# EAGLE design dip8_a1 (EAGLE 5.11)
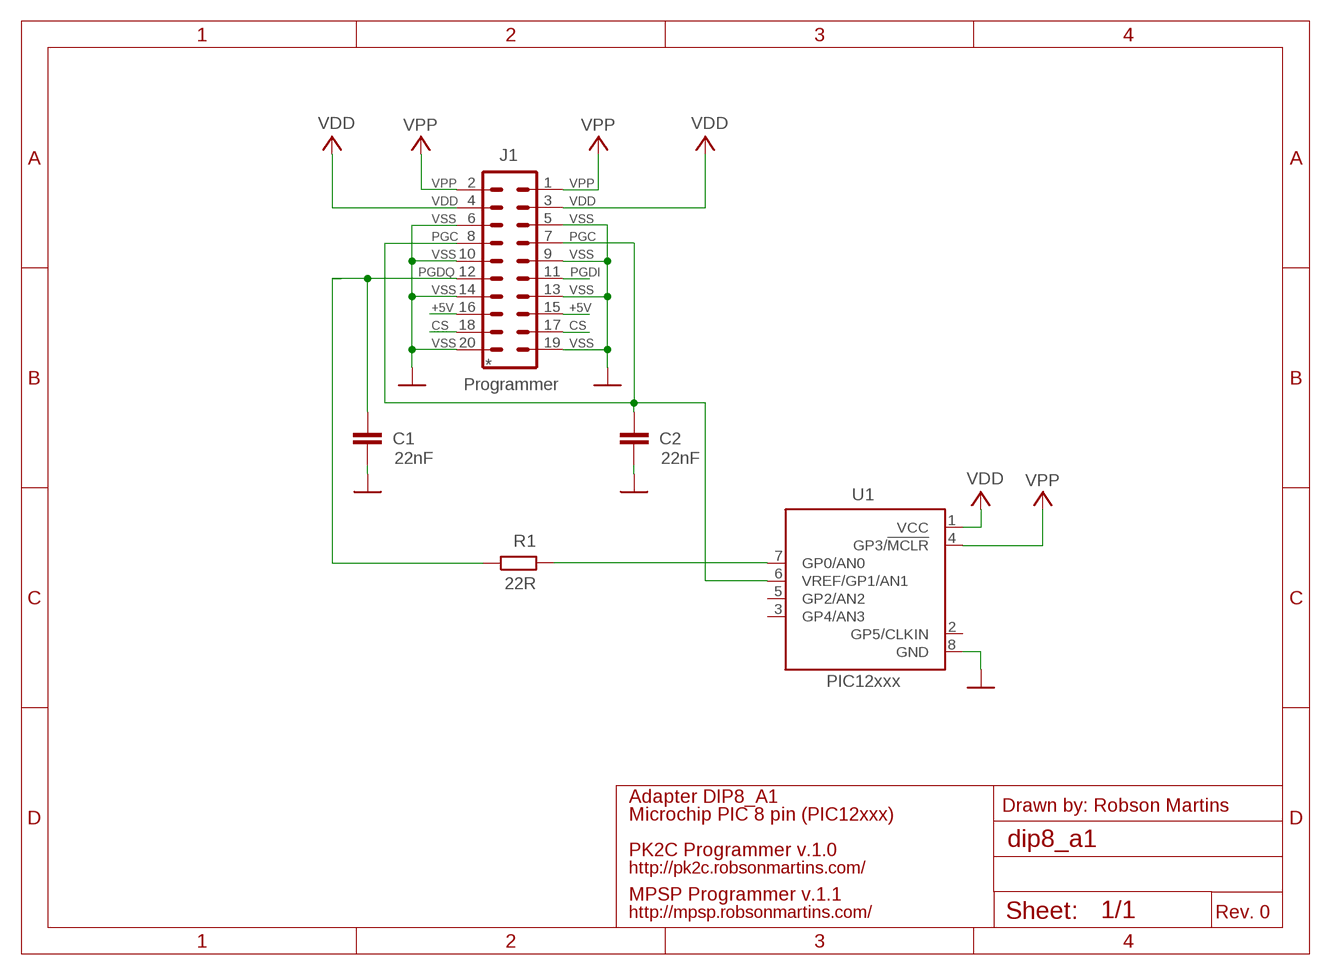
[diagram p0: schematic, sheet 1]

## Parts
C1  22nF  C-EU025-025X050  [C025-025X050]
C2  22nF  C-EU025-025X050  [C025-025X050]
J1  Programmer  MA10-2  [MA10-2]
R1  22R  R-EU_0204/7  [0204/7]
U1  PIC12xxx  PIC12F675P  [DIL8]

## Nets
+5V: J1.15 J1.16
CS: J1.17 J1.18
GND: C1.2 C2.2 J1.5 J1.6 J1.9 J1.10 J1.13 J1.14 J1.19 J1.20 U1.8(GND)
PGC: C2.1 J1.7 J1.8 U1.6(VREF/GP1/AN1)
PGD: C1.1 J1.12 R1.1
PGD_CHIP: R1.2 U1.7(GP0/AN0)
PGDI: J1.11
VDD: J1.3 J1.4 U1.1(VCC)
VPP: J1.1 J1.2 U1.4(GP3/!MCLR)
Unconnected: U1.2(GP5/CLKIN) U1.3(GP4/AN3) U1.5(GP2/AN2)

## Notes on the sheet
- VPP | VPP
- VDD | VDD
- VSS | VSS
- PGC | PGC
- VSS | VSS
- PGDQ | PGDI
- VSS | VSS
- +5V | +5V
- CS | CS
- VSS | VSS
- *
- Adapter DIP8_A1
- Drawn by: Robson Martins
- Microchip PIC 8 pin (PIC12xxx)
- PK2C Programmer v.1.0
- http://pk2c.robsonmartins.com/
- MPSP Programmer v.1.1
- http://mpsp.robsonmartins.com/ | Rev. 0

## Library data of the parts
C1 C2 = rcl:C-EU: CAPACITOR, European symbol
J1 = con-lstb:MA10-2: PIN HEADER; OC_FARNELL: unknown; OC_NEWARK: unknown
R1 = resistor:R-EU_: RESISTOR, European symbol
U1 = microchip:PIC12F675: 8-Pin FLASH-Based 8-Bit CMOS Microcontroller Precision Internal 4 MHz oscillator factory calibrated to ±1% Low Power Features: Standby Current: - 1 nA @ 2.0V, typical Operating Current: - 8.5µA @ 32 kHz, 2.0V, typical - 100µA @ 1 MHz, 2.0V, typical Watchdog Timer Current: - 300 nA @ 2.0V, typical Timer1 oscillator current: - 4µA @ 32 kHz, 2.0V, typical Analog-to-Digital Converter module: - 10-bit resolution - Programmable 4-channel input - Voltage reference input Source: http://www.microchip.com .. 41190E.pdf; MF: MICROCHIP; MPN: PIC12F675-E/P; OC_FARNELL: 9759018; OC_NEWARK: 92C4340

## Board
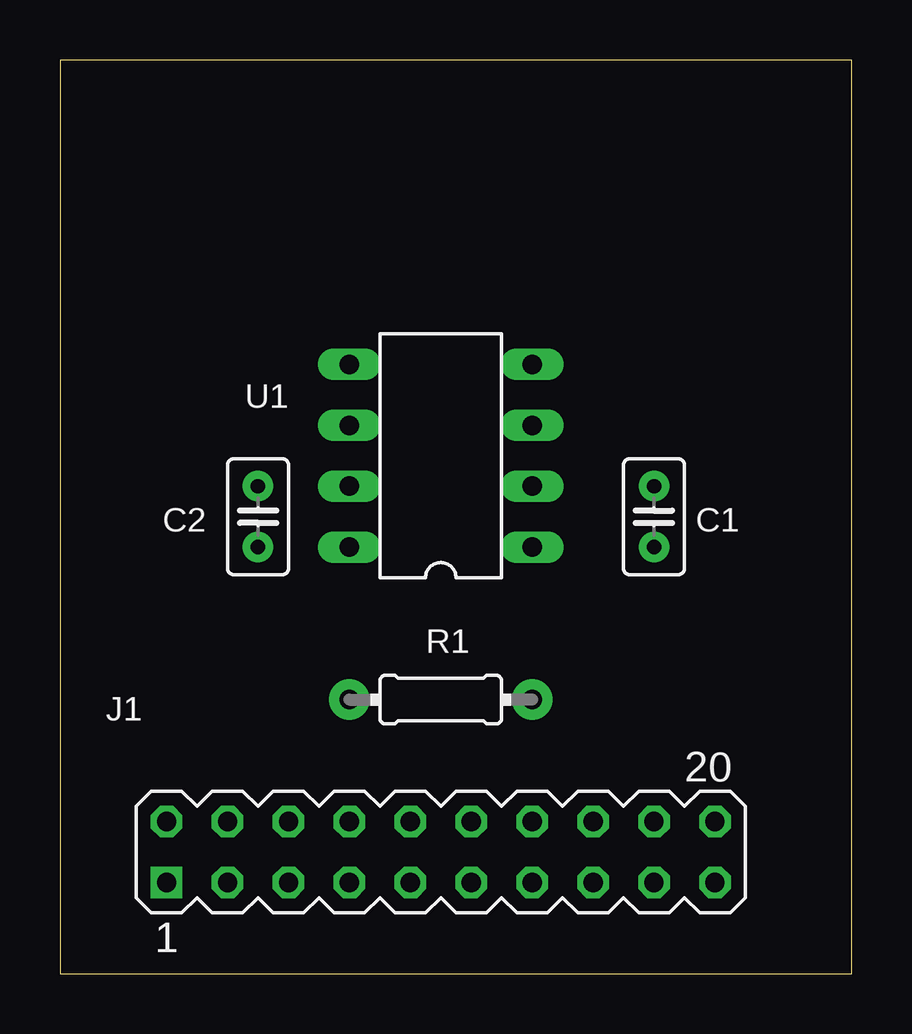
[diagram p1: board, top side]
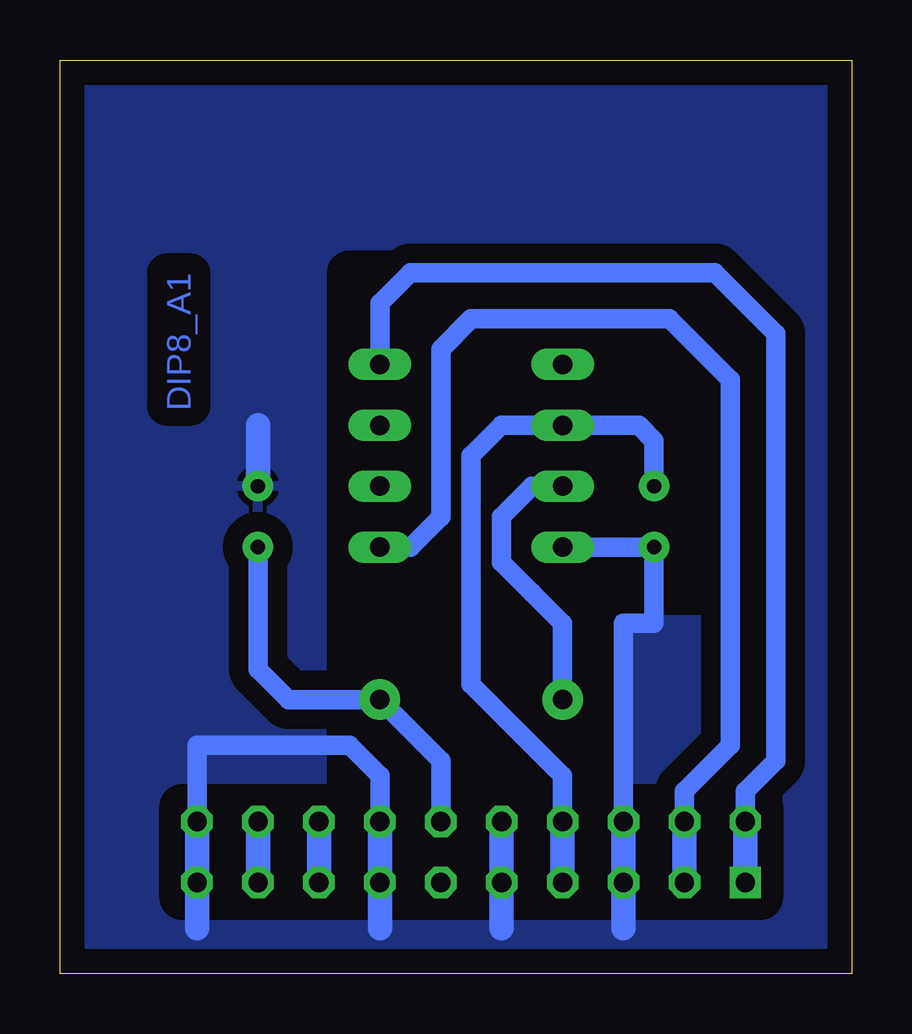
[diagram p2: board, bottom side, seen from below]

Size 33.02 x 38.08 mm. Coordinates in mm from the lower left corner, seen from the top.
Outline: 33.02,0 33.02,38.08 0,38.08 0,0 33.02,0
Copper layers (1*16): Top 0.035mm / dielectric 1.5mm / Bottom 0.035mm
Design rules "default": minimum track width 10mil, minimum drill 24mil, track to track 8mil, track to pad 8mil, pad to pad 8mil, via to via 8mil, smd to smd 8mil, copper to edge 40mil, drill to drill 8mil, minimum pad ring 10mil, minimum via ring 8mil, stop-mask expansion 4mil, vias tented up to drill 0mil, thermal gap 10mil
bRestrict: area 3.8,3.2 to 27.9,15.9; area 5.7,15.9 to 21,29.2

### Footprints (pad centres in the part's own frame; a part is rotated, then mirrored left to right if it is on the bottom)
C025-025X050 = drill 0.6 pad 1.27 round: 1 -1.27,0; 2 1.27,0
MA10-2 = drill 0.8 pad 1.27 square: 1 -11.43,-1.27 | drill 0.8 pad 1.27 octagon: 2 -11.43,1.27; 3 -8.89,-1.27; 4 -8.89,1.27; 5 -6.35,-1.27; 6 -6.35,1.27; 7 -3.81,-1.27; 8 -3.81,1.27; 9 -1.27,-1.27; 10 -1.27,1.27; 11 1.27,-1.27; 12 1.27,1.27; 13 3.81,-1.27; 14 3.81,1.27; 15 6.35,-1.27; 16 6.35,1.27; 17 8.89,-1.27; 18 8.89,1.27; 19 11.43,-1.27; 20 11.43,1.27
0204/7 = drill 0.813 pad 1.676 round: 1 -3.81,0 | drill 0.8 pad 1.676 round: 2 3.81,0
DIL8 = drill 0.813 long: 1 -3.81,-3.81; 2 -1.27,-3.81; 3 1.27,-3.81; 4 3.81,-3.81; 5 3.81,3.81; 6 1.27,3.81; 7 -1.27,3.81; 8 -3.81,3.81

### Placement (x,y rotation side)
C1  24.77,19.05 90 top
C2  8.26,19.05 270 top
J1  15.88,5.08 0 top
R1  15.88,11.43 180 top
U1  15.88,21.59 90 top

### Tracks (layer width: path | path; a pad name or v marks a point on that pad's centre or on a via)
+5V
  Bottom 1.016: J1.15 J1.16
CS
  Bottom 1.016: J1.17 J1.18
GND
  Bottom 0.813: U1.8 C2.2 8.26,14.61 9.53,14.61 J1.6 | J1.14 19.69,8.26 20.96,9.53 27.31,9.53 J1.20
  Bottom 1.016: J1.6 J1.5 9.53,1.91 | J1.10 J1.9 14.61,1.91 | J1.14 J1.13 19.69,1.91 | J1.20 J1.19 27.31,1.91 | C1.2 24.77,22.86
  pour Bottom (isolate 0.813): 33.02,0 0,0 0,38.1 33.02,38.1
PGC
  Bottom 0.813: C2.1 8.26,22.23 8.89,22.86 U1.6 14.61,22.86 15.88,21.59 15.88,12.06 12.07,8.26 J1.8
  Bottom 1.016: J1.7 J1.8
PGD
  Bottom 0.813: C1.1 24.77,12.7 23.5,11.43 R1.1 17.15,8.89 J1.12
PGD_CHIP
  Bottom 0.813: U1.7 13.34,20.32 14.61,19.05 14.61,17.14 13.34,15.88 12.07,14.61 R1.2
VDD
  Bottom 0.813: J1.4 6.99,7.62 5.08,9.53 5.08,24.77 7.62,27.3 15.88,27.3 17.15,26.04 17.15,19.05 18.42,17.78 U1.1
  Bottom 1.016: J1.3 J1.4
VPP
  Bottom 0.813: U1.4 19.69,27.3 19.69,27.94 18.42,29.21 5.72,29.21 3.18,26.67 3.18,8.89 4.45,7.62 J1.1
  Bottom 1.016: J1.1 J1.2

### Text on the board
Bottom: DIP8_A1
tDocu: Microchip PIC | PIC 12xxx | DIP8_A1 | Adapter | VSS | VPP | VDD | VSS | PGC | VSS | PGD | VSS | +5V | CS